# Altium schematic sheet Cuurent Monitored Power Switch.SchDoc
size A
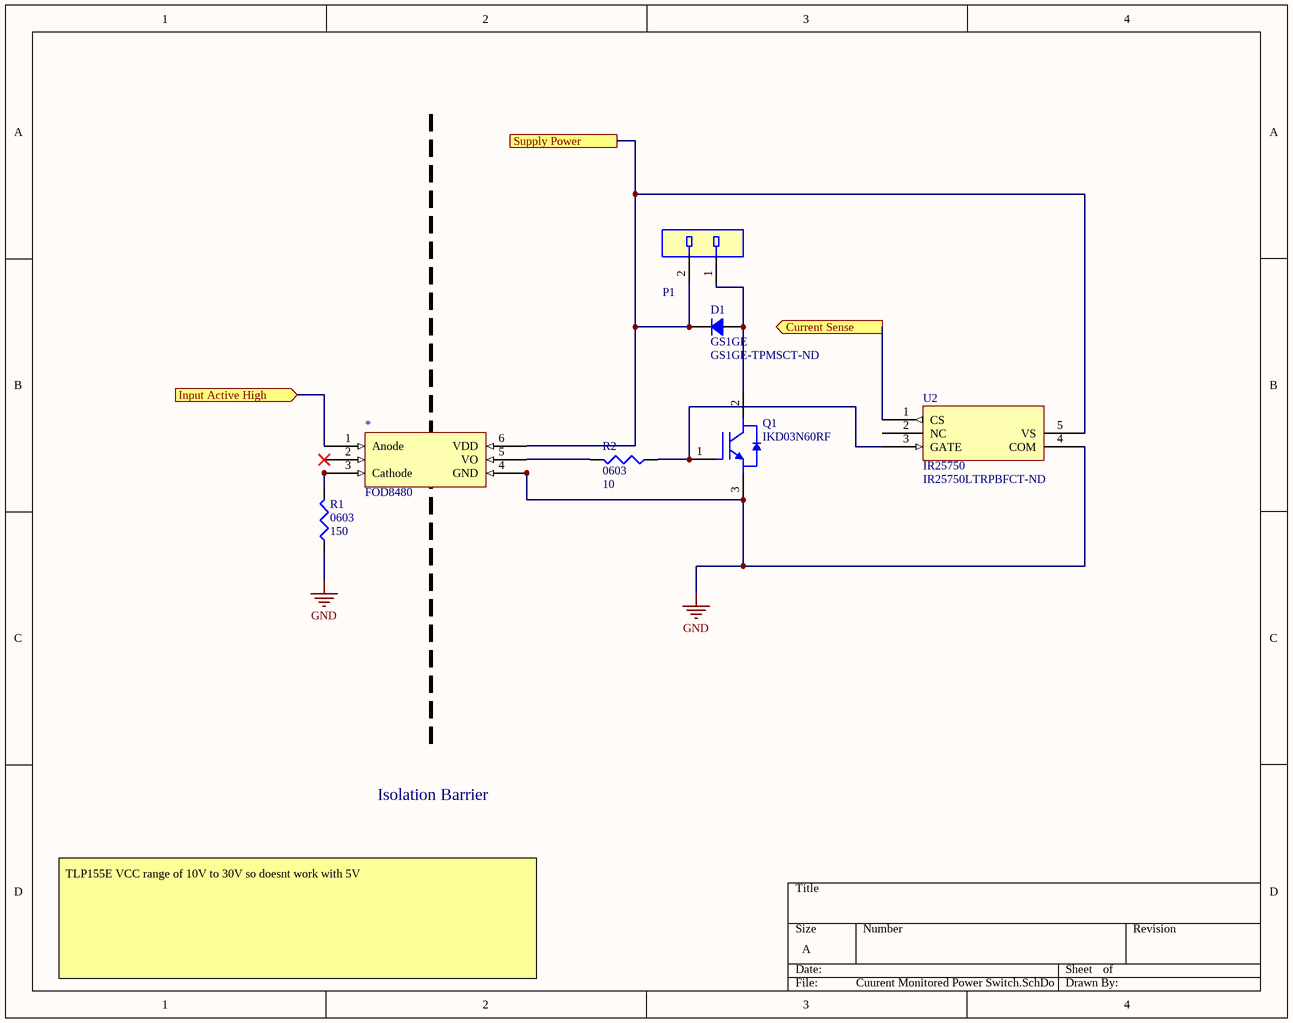
[diagram p0: Cuurent Monitored Power Switch.SchDoc]

## Parts
*  FOD8480  [SOIC127P1030X348-6N]
D1  GS1GE  Supplier Part Number 1: GS1GE-TPMSCT-ND  [DO214AC SMA]
P1  70553-0001  [Molex_70553-0001_MFG]  (value not drawn)
Q1  IKD03N60RF  [INF-PG-TO252-3-21_V]
R1  0603  value 150  [J1-0603]
R2  0603  value 10  [J1-0603]
U2  IR25750  Supplier Part Number 1: IR25750LTRPBFCT-ND  [SOT23-5]

## Ports
Current Sense (out), Input Active High (in), Supply Power

## Nets
GND: *.4(GND) Q1.3(E) R1.1 U2.4(COM)
Current Sense: U2.1(CS) ; port Current Sense
Input Active High: *.1(Anode) ; port Input Active High
Supply Power: *.6(VDD) D1.2 P1.2 U2.5(VS) ; port Supply Power
Net*_3: *.3(Cathode) R1.2
Net*_5: *.5(VO) R2.2
NetD1_1: D1.1 P1.1 Q1.2(C)
NetQ1_1: Q1.1(G) R2.1 U2.3(GATE)

Not connected (* = marked no-connect by the designer): * 2*; U2 2(NC)

## Notes on the sheet
- Isolation Barrier
- TLP155E VCC range of 10V to 30V so doesnt work with 5V

## Library data of the parts
D1 = GS1GE: Diode Switching 400V 1A 2-Pin SMAE T/R; Manufacturer: MCC; Manufacturer Part Number: GS1GE-TP; Supplier 1: Digi-Key; RoHS: Yes; Category: Rectifier Diodes; Stock 1: 2437; Pricing 1: 1=0.27000, 10=0.22100, 25=0.18560, 100=0.09060, 250=0.08920, 500=0.07560, 1000=0.05253, 2500=0.04882 (USD); Mount: Surface Mount; Number of Pins: 2; Max Reverse Voltage (DC): 400V; Packaging: Tape and Reel; Average Rectified Current: 1A; Lead Free: Lead Free; ComponentLink1URL: https://media.digikey.com/pdf/Data%20Sheets/Micro%20Commercial%20PDFs/GS1AE-GS1ME(SMAE)_Rev.F_Oct19_2015_DS.pdf?src-supplier=Digi-Key; ComponentLink1Description: https://media.digikey.com/pdf/Data%20Sheets/Micro%20Commercial%20PDFs/GS1AE-GS1ME(SMAE)_Rev.F_Oct19_2015_DS.pdf?src-supplier=Digi-Key; ComponentLink2URL: http://components.arrow.com/part/dataview/43471173S9417573N2022?src-supplier=Arrow; ComponentLink2Description: http://components.arrow.com/part/dataview/43471173S9417573N2022?src-supplier=Arrow; ComponentLink3URL: http://www.mccsemi.com/up_pdf/GS1AE-GS1ME(SMAE).pdf?src-supplier=Digi-Key; ComponentLink3Description: http://www.mccsemi.com/up_pdf/GS1AE-GS1ME(SMAE).pdf?src-supplier=Digi-Key
P1 = 70553-0001: 24V power in
Q1 = CMP-1166-00103-1: 600 V TrenchStop RC-Series for Hard Switching Applications up to 30 KHz, 5 A IC, -40 to 175 degC, PG-TO252-3-21, Reel, Green; Manufacturer: Infineon; Green: TRUE; VCE(sat)(typ): 2.2Â V; tr(typ): 8 ns; IC(max)@ 100degrees: 2.5Â A; Eoff(typ): 0.04Â mJ; Eon(typ): 0.05Â mJ; VF (typ): 2.1Â V; Switching Frequency: RC Drives Fast Series 4 - 30 kHz; Qrr(typ): 0.06Â uC; tf(typ): 93 ns; IFpuls(max): 7.5Â A; IF (max): 5Â A; td(off) (typ): 128 ns; td(on)(typ): 10 ns; Irrm(typ): 3.8 A; Ptot(max): 53.6 W; VCE(max): 600Â V; QGate (typ): 17.1Â nC; ComponentLink1URL: http://www.infineon.com/; Mounting Technology: Surface Mount; Packing: Reel; ComponentLink2Description: Datasheet; ComponentLink3Description: Package Specification; Product Type: IKD03N60RF; PackageDescription: 3-Pin Plastic (Green) Transistor Single Outline Package, Body 6.1 x 6.6 mm, Pitch 2.29 mm; ComponentLink2URL: http://www.infineon.com/dgdl/IKD03N60RF+Rev+2.2.pdf?folderId=db3a3043156fd5730115f56849b61941&fileId=db3a30433c5c92fb013c5d3978350068; IC(max)@ 25degrees: 5Â A; PartNumber: IKD03N60RF; ICpuls(max): 7.5Â A; DatasheetVersion: Rev. 2.2; PackageReference: PG-TO252-3-21; ComponentLink1Description: Manufacturer URL; ComponentLink3URL: http://www.infineon.com/cms/packages/SMD_-_Surface_Mounted_Devices/P-PG-TO252/P-PG-TO252-03-021.html?__locale=en; Halogen-free: TRUE
R1 R2 = Res3: Resistor; Published: 8-Jun-2000; LatestRevisionDate: 29-May-2009; LatestRevisionNote: IPC-7351 Footprint Added.; PackageReference: J1-0603; Publisher: Altium Limited; PackageDescription: Chip Resistor
U2 = IR25750: 1.8V/2.5V/3.3V/5V/9V/12V/15V/18V/24V 5-Pin SOT-23 T/R; Manufacturer: International Rectifier; Manufacturer Part Number: IR25750LTRPBF; Operating Supply Current: 50uA; Max Supply Voltage: 600V; Min Supply Voltage: -3V; Supplier 1: Digi-Key; RoHS: Yes; Category: Power Management ICs; Stock 1: 2771; Pricing 1: 1=0.79000, 10=0.69900, 25=0.65680, 100=0.49790, 250=0.42376, 500=0.40256, 1000=0.30721 (USD); Mount: Surface Mount; Case/Package: SOT-23-5; Number of Pins: 5; Weight: 0.001058oz; Min Operating Temperature: -40°C; Max Operating Temperature: 125°C; Package Quantity: 1; Packaging: Tape and Reel; Max Supply Current: 50uA; Length: 3mm; Height: 1.3mm; Width: 1.75mm; Lead Free: Lead Free; ComponentLink1URL: https://datasheet.ciiva.com/29590/ir25750lpbf-preliminary-29590193.pdf?src-supplier=Digi-Key; ComponentLink1Description: https://datasheet.ciiva.com/29590/ir25750lpbf-preliminary-29590193.pdf?src-supplier=Digi-Key